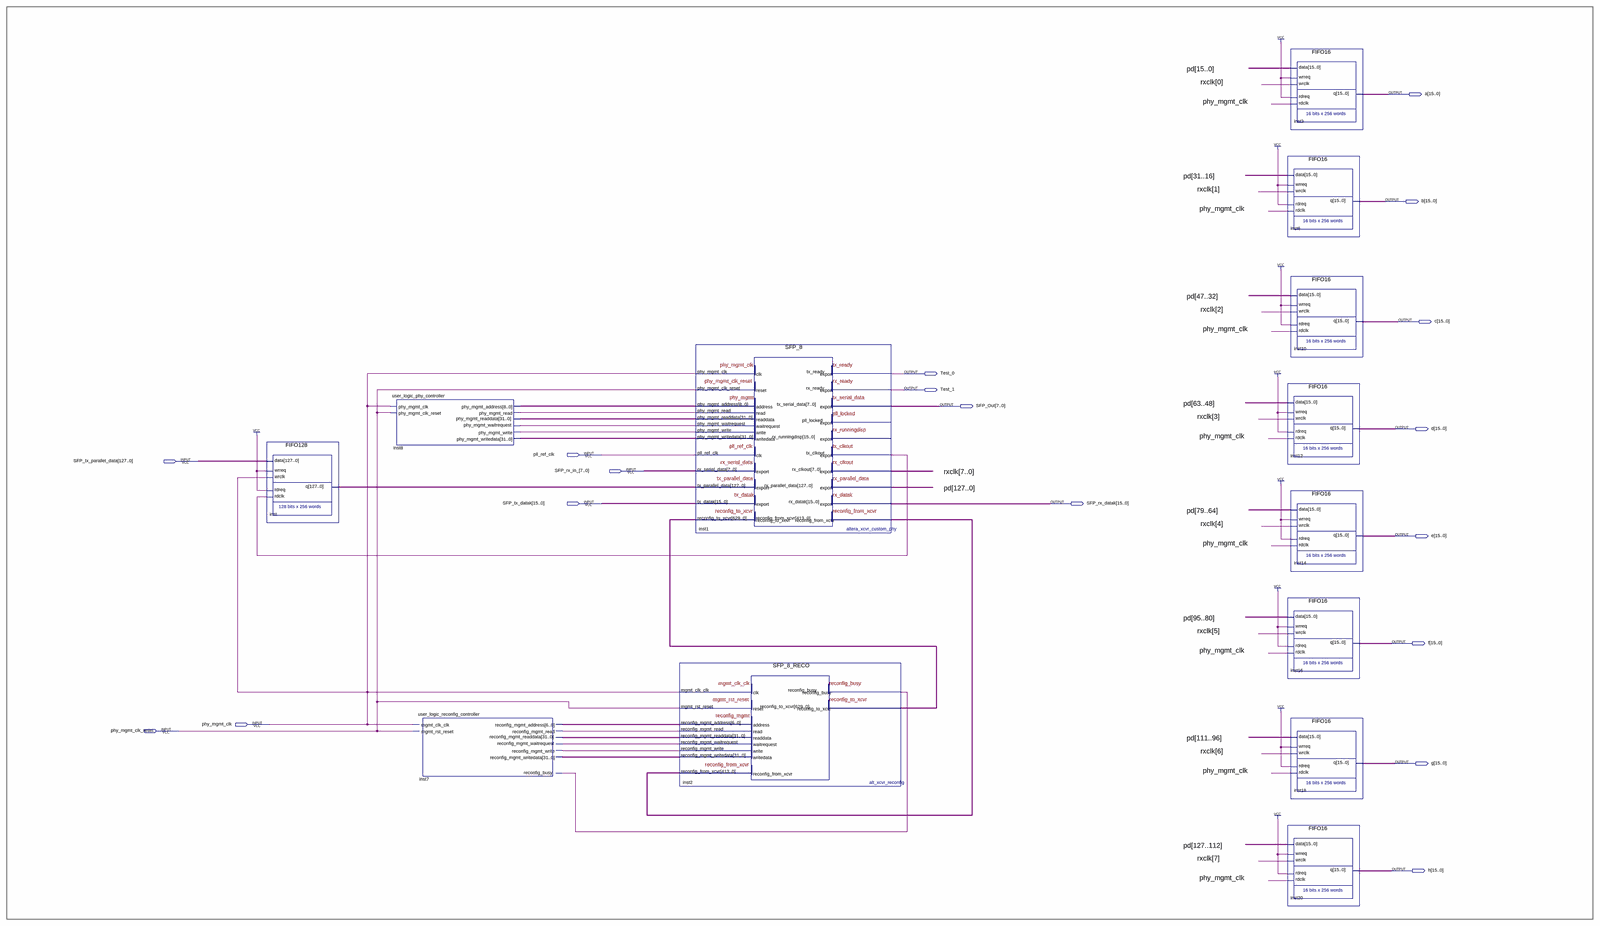
[diagram p0: schematic sheet, whole]
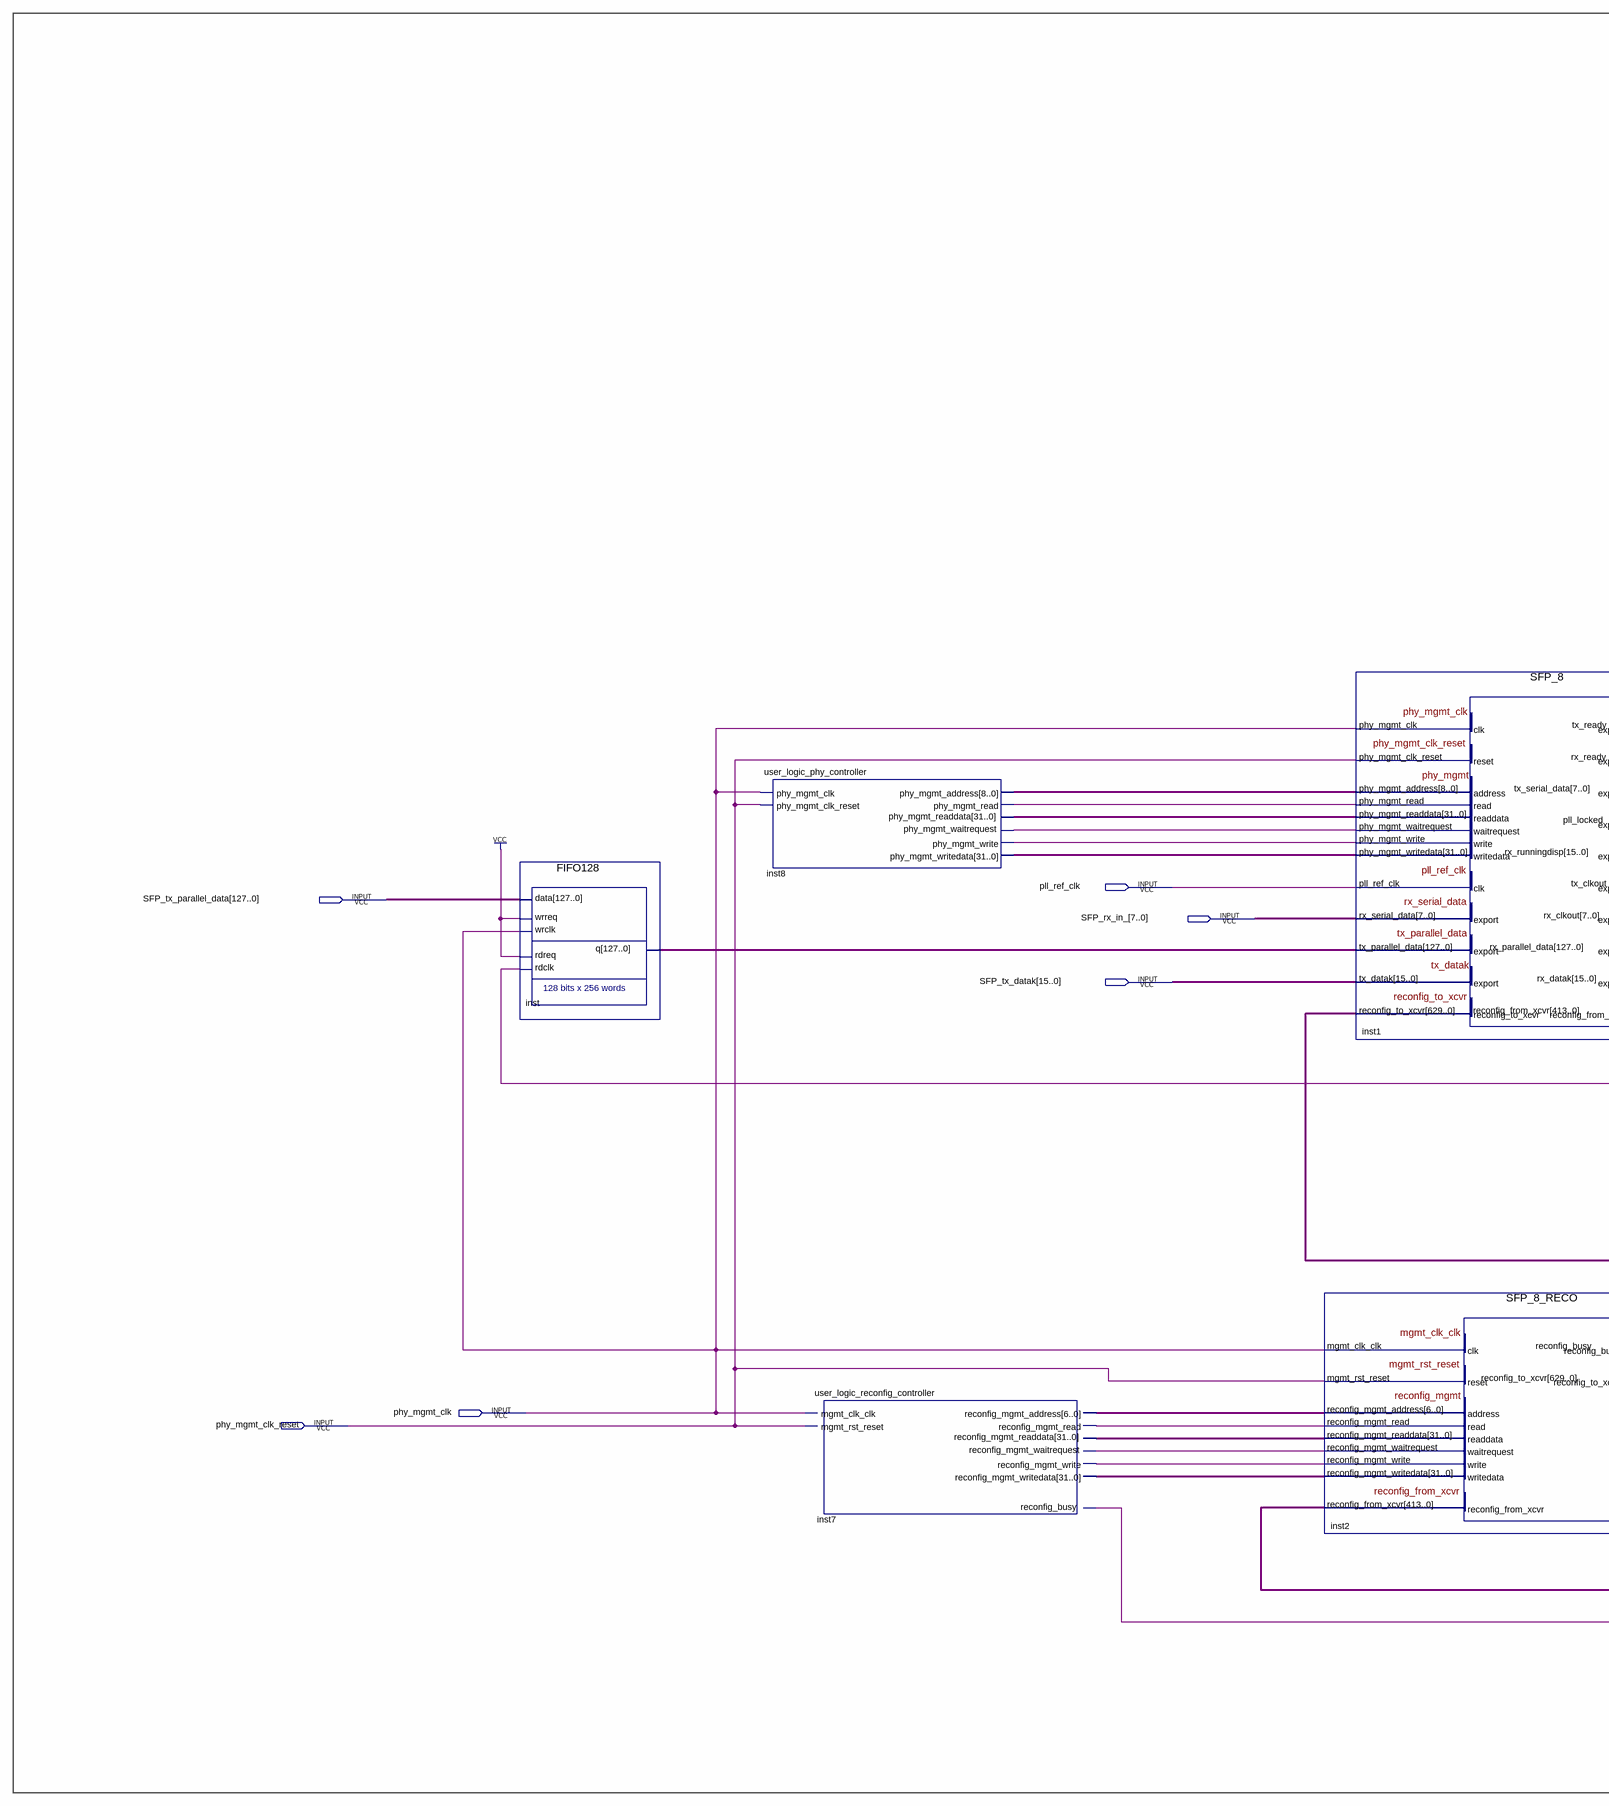
[diagram p1: schematic sheet, left part]
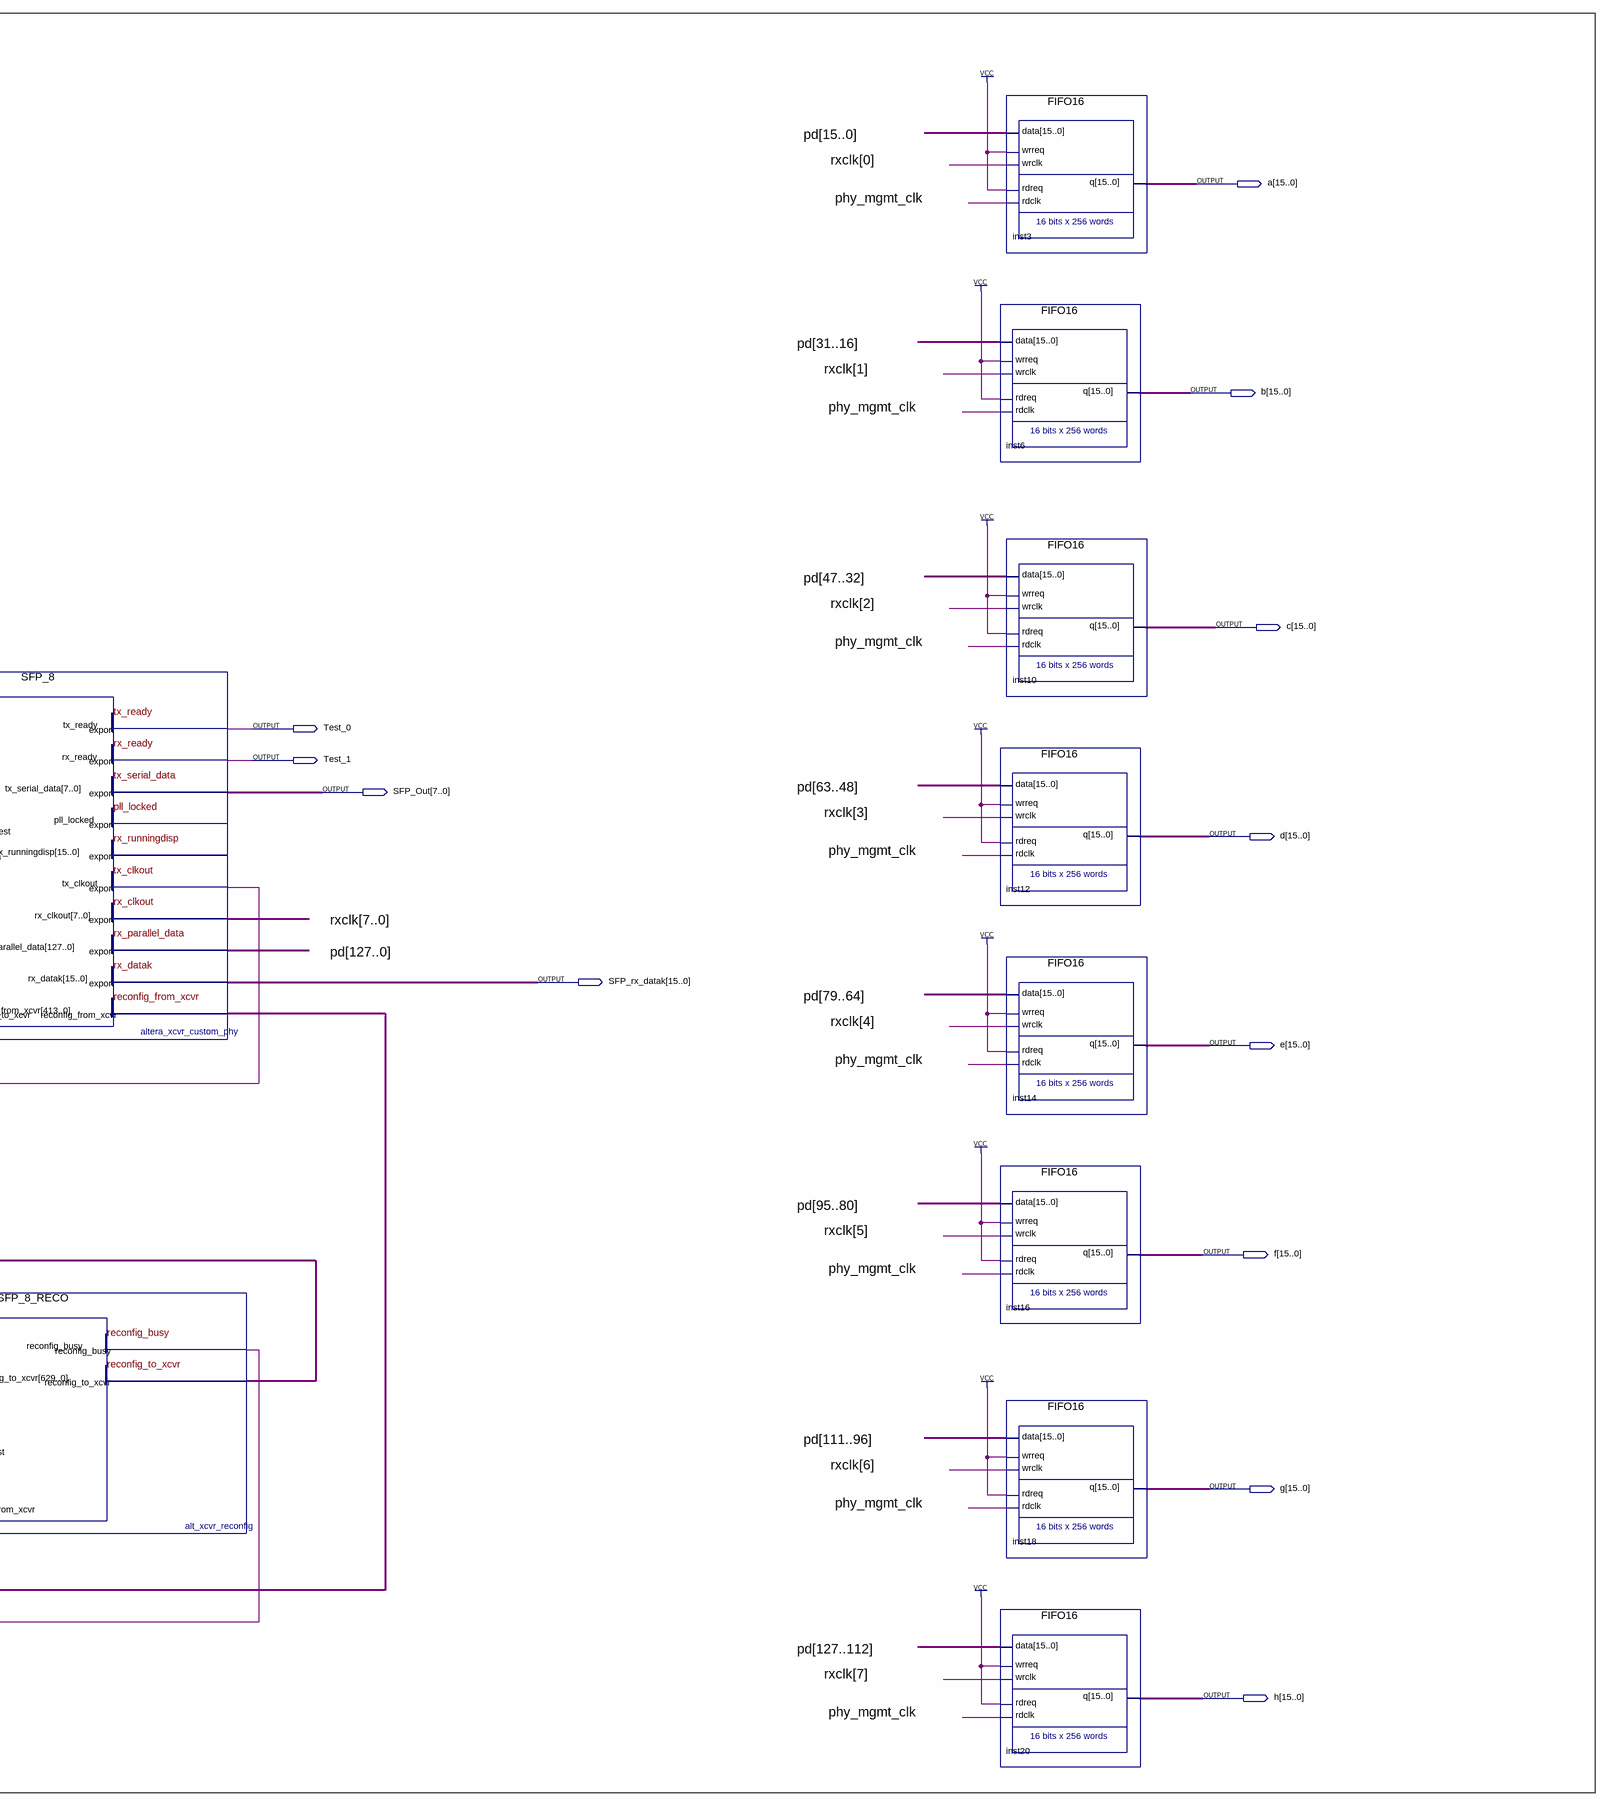
[diagram p2: schematic sheet, right part]
// Quartus schematic SFP_GxBlock_x8.bdf as structural Verilog: 13 symbols, 18 pins
module SFP_GxBlock_x8 (
  input  pll_ref_clk,
  input  [127:0] SFP_tx_parallel_data,
  input  [7:0] SFP_rx_in_,
  input  [15:0] SFP_tx_datak,
  input  phy_mgmt_clk,
  input  phy_mgmt_clk_reset,
  output [15:0] a,
  output [15:0] b,
  output [15:0] c,
  output Test_0,
  output Test_1,
  output [7:0] SFP_Out,
  output [15:0] d,
  output [15:0] SFP_rx_datak,
  output [15:0] e,
  output [15:0] f,
  output [15:0] g,
  output [15:0] h
);

  wire inst1_phy_mgmt_waitrequest, inst1_tx_clkout, inst2_reconfig_busy, inst2_reconfig_mgmt_waitrequest,
       inst7_reconfig_mgmt_read, inst7_reconfig_mgmt_write, inst8_phy_mgmt_read, inst8_phy_mgmt_write;
  wire [6:0] inst7_reconfig_mgmt_address;
  wire [7:0] rxclk;
  wire [8:0] inst8_phy_mgmt_address;
  wire [31:0] inst1_phy_mgmt_readdata, inst2_reconfig_mgmt_readdata, inst7_reconfig_mgmt_writedata,
       inst8_phy_mgmt_writedata;
  wire [127:0] inst_q, pd;
  wire [413:0] inst1_reconfig_from_xcvr;
  wire [629:0] inst2_reconfig_to_xcvr;

  FIFO128 inst (
    .data(SFP_tx_parallel_data), .wrreq(1'b1), .wrclk(phy_mgmt_clk), .rdreq(1'b1), .rdclk(inst1_tx_clkout),
    .q(inst_q));
  user_logic_phy_controller inst8 (
    .phy_mgmt_clk(phy_mgmt_clk), .phy_mgmt_clk_reset(phy_mgmt_clk_reset),
    .phy_mgmt_readdata(inst1_phy_mgmt_readdata), .phy_mgmt_waitrequest(inst1_phy_mgmt_waitrequest),
    .phy_mgmt_address(inst8_phy_mgmt_address), .phy_mgmt_read(inst8_phy_mgmt_read),
    .phy_mgmt_write(inst8_phy_mgmt_write), .phy_mgmt_writedata(inst8_phy_mgmt_writedata));
  user_logic_reconfig_controller inst7 (
    .reconfig_busy(inst2_reconfig_busy), .mgmt_clk_clk(phy_mgmt_clk), .mgmt_rst_reset(phy_mgmt_clk_reset),
    .reconfig_mgmt_readdata(inst2_reconfig_mgmt_readdata),
    .reconfig_mgmt_waitrequest(inst2_reconfig_mgmt_waitrequest),
    .reconfig_mgmt_address(inst7_reconfig_mgmt_address), .reconfig_mgmt_read(inst7_reconfig_mgmt_read),
    .reconfig_mgmt_write(inst7_reconfig_mgmt_write), .reconfig_mgmt_writedata(inst7_reconfig_mgmt_writedata));
  SFP_8 inst1 (
    .phy_mgmt_clk(phy_mgmt_clk), .phy_mgmt_clk_reset(phy_mgmt_clk_reset),
    .phy_mgmt_address(inst8_phy_mgmt_address), .phy_mgmt_read(inst8_phy_mgmt_read),
    .phy_mgmt_write(inst8_phy_mgmt_write), .phy_mgmt_writedata(inst8_phy_mgmt_writedata),
    .pll_ref_clk(pll_ref_clk), .rx_serial_data(SFP_rx_in_), .tx_parallel_data(inst_q),
    .tx_datak(SFP_tx_datak), .reconfig_to_xcvr(inst2_reconfig_to_xcvr),
    .phy_mgmt_readdata(inst1_phy_mgmt_readdata), .phy_mgmt_waitrequest(inst1_phy_mgmt_waitrequest),
    .tx_ready(Test_0), .rx_ready(Test_1), .tx_serial_data(SFP_Out), .tx_clkout(inst1_tx_clkout),
    .rx_clkout(rxclk), .rx_parallel_data(pd), .rx_datak(SFP_rx_datak),
    .reconfig_from_xcvr(inst1_reconfig_from_xcvr));  // open: pll_locked, rx_runningdisp
  SFP_8_RECO inst2 (
    .mgmt_clk_clk(phy_mgmt_clk), .mgmt_rst_reset(phy_mgmt_clk_reset),
    .reconfig_mgmt_address(inst7_reconfig_mgmt_address), .reconfig_mgmt_read(inst7_reconfig_mgmt_read),
    .reconfig_mgmt_write(inst7_reconfig_mgmt_write), .reconfig_mgmt_writedata(inst7_reconfig_mgmt_writedata),
    .reconfig_from_xcvr(inst1_reconfig_from_xcvr), .reconfig_busy(inst2_reconfig_busy),
    .reconfig_mgmt_readdata(inst2_reconfig_mgmt_readdata),
    .reconfig_mgmt_waitrequest(inst2_reconfig_mgmt_waitrequest), .reconfig_to_xcvr(inst2_reconfig_to_xcvr));
  FIFO16 inst3 (.data(pd[15:0]), .wrreq(1'b1), .wrclk(rxclk[0]), .rdreq(1'b1), .rdclk(phy_mgmt_clk), .q(a));
  FIFO16 inst6 (.data(pd[31:16]), .wrreq(1'b1), .wrclk(rxclk[1]), .rdreq(1'b1), .rdclk(phy_mgmt_clk), .q(b));
  FIFO16 inst10 (.data(pd[47:32]), .wrreq(1'b1), .wrclk(rxclk[2]), .rdreq(1'b1), .rdclk(phy_mgmt_clk), .q(c));
  FIFO16 inst12 (.data(pd[63:48]), .wrreq(1'b1), .wrclk(rxclk[3]), .rdreq(1'b1), .rdclk(phy_mgmt_clk), .q(d));
  FIFO16 inst14 (.data(pd[79:64]), .wrreq(1'b1), .wrclk(rxclk[4]), .rdreq(1'b1), .rdclk(phy_mgmt_clk), .q(e));
  FIFO16 inst16 (.data(pd[95:80]), .wrreq(1'b1), .wrclk(rxclk[5]), .rdreq(1'b1), .rdclk(phy_mgmt_clk), .q(f));
  FIFO16 inst18 (.data(pd[111:96]), .wrreq(1'b1), .wrclk(rxclk[6]), .rdreq(1'b1), .rdclk(phy_mgmt_clk), .q(g));
  FIFO16 inst20 (.data(pd[127:112]), .wrreq(1'b1), .wrclk(rxclk[7]), .rdreq(1'b1), .rdclk(phy_mgmt_clk), .q(h));
endmodule
